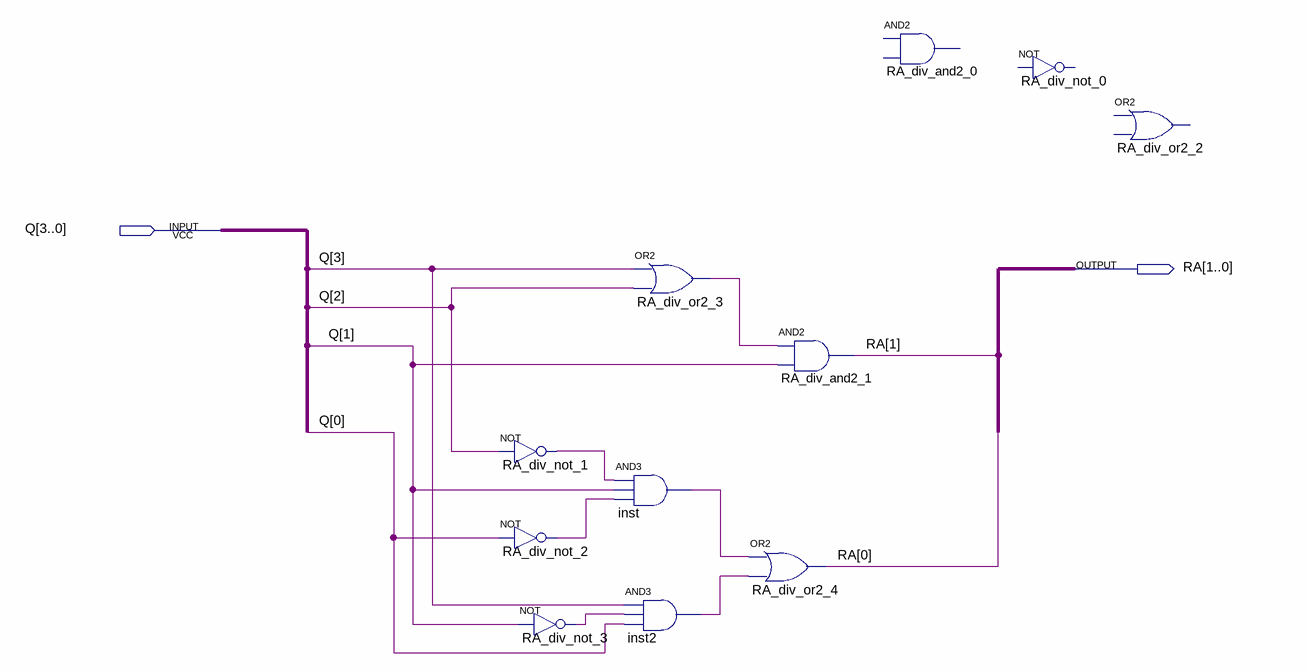
[diagram p0: schematic sheet]
// Quartus schematic RA_Division.bdf as structural Verilog: 11 symbols, 2 pins
module RA_Division (
  input  [3:0] Q,
  output [1:0] RA
);

  wire inst2_out, inst_out, RA_div_not_1_out, RA_div_not_2_out, RA_div_not_3_out, RA_div_or2_3_out;

  not RA_div_not_1 (RA_div_not_1_out, Q[2]);
  not RA_div_not_2 (RA_div_not_2_out, Q[0]);
  not RA_div_not_3 (RA_div_not_3_out, Q[1]);
  or RA_div_or2_3 (RA_div_or2_3_out, Q[3], Q[2]);
  and inst (inst_out, RA_div_not_1_out, Q[1], RA_div_not_2_out);
  and inst2 (inst2_out, Q[3], RA_div_not_3_out, Q[0]);
  or RA_div_or2_4 (RA[0], inst_out, inst2_out);
  and RA_div_and2_1 (RA[1], RA_div_or2_3_out, Q[1]);
  // AND2 RA_div_and2_0 is placed but not wired
  // NOT RA_div_not_0 is placed but not wired
  // OR2 RA_div_or2_2 is placed but not wired
endmodule
